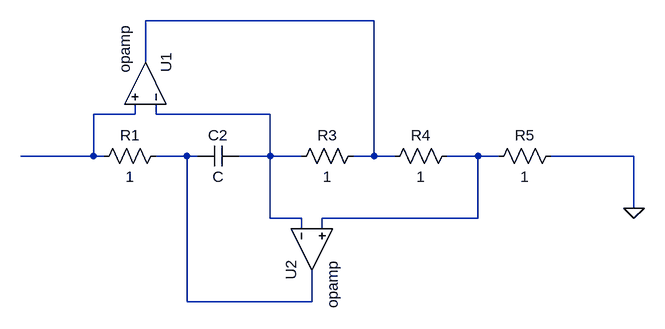
[diagram p0: schematic inductor activado.asc]
inductor activado.asc, the LTspice schematic file:
Version 4
SHEET 1 916 680
WIRE 496 -80 144 -80
WIRE 144 -16 144 -80
WIRE 128 64 128 48
WIRE 128 64 64 64
WIRE 160 64 160 48
WIRE 336 64 160 64
WIRE 64 128 64 64
WIRE 64 128 -48 128
WIRE 80 128 64 128
WIRE 208 128 160 128
WIRE 224 128 208 128
WIRE 336 128 336 64
WIRE 336 128 288 128
WIRE 384 128 336 128
WIRE 496 128 496 -80
WIRE 496 128 464 128
WIRE 528 128 496 128
WIRE 656 128 608 128
WIRE 688 128 656 128
WIRE 896 128 768 128
WIRE 896 208 896 128
WIRE 336 224 336 128
WIRE 384 224 336 224
WIRE 656 224 656 128
WIRE 656 224 416 224
WIRE 384 240 384 224
WIRE 416 240 416 224
WIRE 208 352 208 128
WIRE 400 352 400 304
WIRE 400 352 208 352
FLAG 896 208 0
SYMBOL res 176 112 R90
WINDOW 0 0 56 VBottom 2
WINDOW 3 32 56 VTop 2
SYMATTR InstName R1
SYMATTR Value 1
SYMBOL OpAmps\\opamp 208 16 M270
SYMATTR InstName U1
SYMBOL cap 288 112 R90
WINDOW 0 0 32 VBottom 2
WINDOW 3 32 32 VTop 2
SYMATTR InstName C2
SYMBOL res 480 112 R90
WINDOW 0 0 56 VBottom 2
WINDOW 3 32 56 VTop 2
SYMATTR InstName R3
SYMATTR Value 1
SYMBOL res 624 112 R90
WINDOW 0 0 56 VBottom 2
WINDOW 3 32 56 VTop 2
SYMATTR InstName R4
SYMATTR Value 1
SYMBOL res 784 112 R90
WINDOW 0 0 56 VBottom 2
WINDOW 3 32 56 VTop 2
SYMATTR InstName R5
SYMATTR Value 1
SYMBOL OpAmps\\opamp 336 272 M90
SYMATTR InstName U2

The netlist it stands for:
* inductor activado.asc
R1 N004 N002 1
XU1 N003 N002 N001 opamp Aol=100K GBW=10Meg  ; pins invin noninvin out
C2 N003 N004 C
R3 N001 N003 1
R4 N005 N001 1
R5 0 N005 1
XU2 N003 N005 N004 opamp Aol=100K GBW=10Meg  ; pins invin noninvin out
.backanno
.end